# EAGLE design BluetoothBoard (EAGLE 7.5.0)
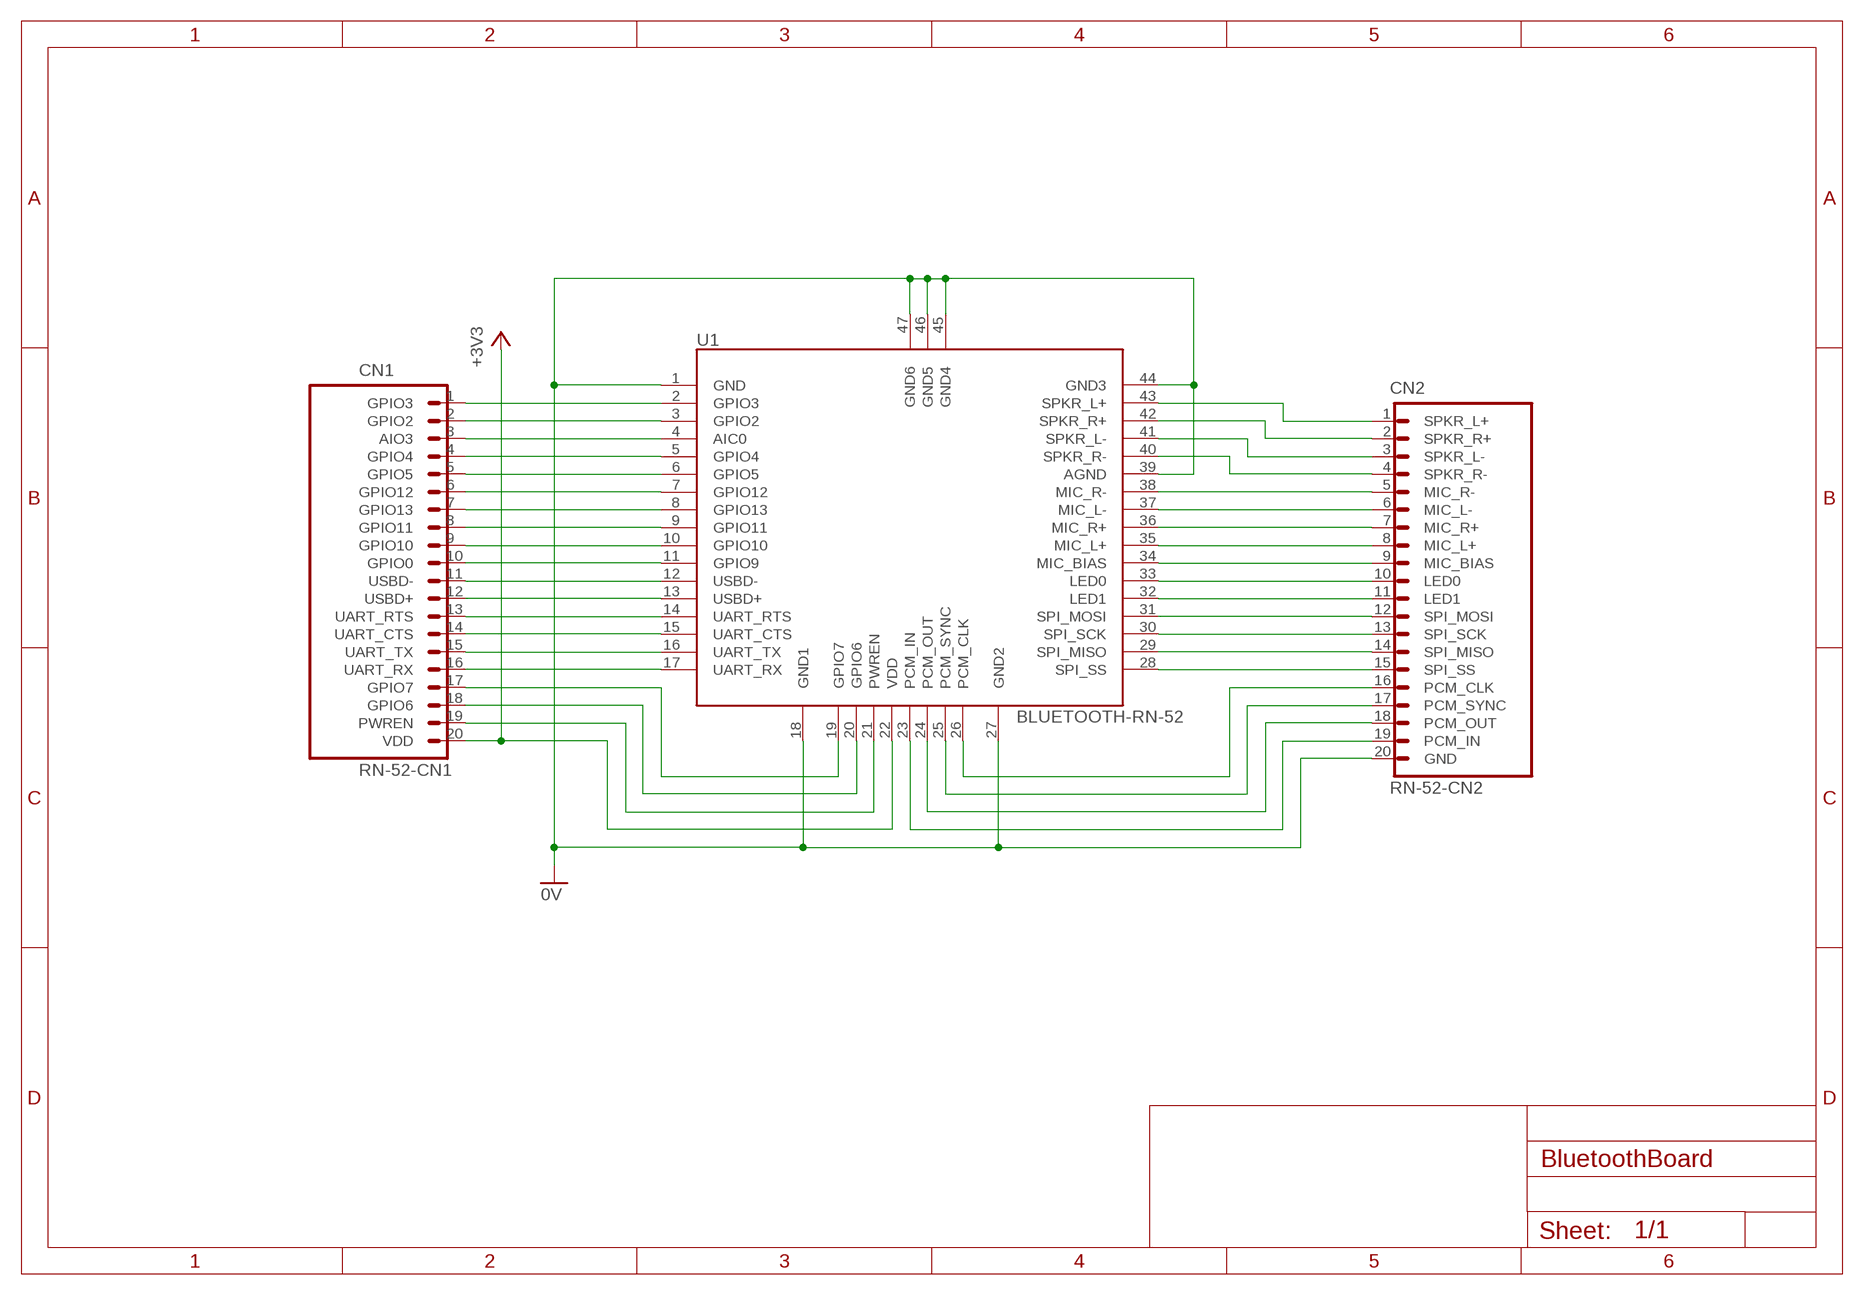
[diagram p0: schematic, sheet 1]

## Parts
CN1  RN-52-CN1  [RN-52-CN1]
CN2  RN-52-CN2  [RN-52-CN2]
U1  BLUETOOTH-RN-52  [RN-52]

## Nets
0V: CN2.20(GND) U1.1(GND) U1.18(GND1) U1.27(GND2) U1.39(AGND) U1.44(GND3) U1.45(GND4) U1.46(GND5) U1.47(GND6)
+3V3: CN1.20(VDD) U1.22(VDD)
N$1: CN1.1(GPIO3) U1.2(GPIO3)
N$2: CN1.2(GPIO2) U1.3(GPIO2)
N$3: CN1.3(AIO3) U1.4(AIC0)
N$4: CN1.4(GPIO4) U1.5(GPIO4)
N$5: CN1.5(GPIO5) U1.6(GPIO5)
N$6: CN1.6(GPIO12) U1.7(GPIO12)
N$7: CN1.7(GPIO13) U1.8(GPIO13)
N$8: CN1.8(GPIO11) U1.9(GPIO11)
N$9: CN1.9(GPIO10) U1.10(GPIO10)
N$10: CN1.10(GPIO0) U1.11(GPIO9)
N$11: CN1.11(USBD-) U1.12(USBD-)
N$12: CN1.12(USBD+) U1.13(USBD+)
N$13: CN1.13(UART_RTS) U1.14(UART_RTS)
N$14: CN1.14(UART_CTS) U1.15(UART_CTS)
N$15: CN1.15(UART_TX) U1.16(UART_TX)
N$16: CN1.16(UART_RX) U1.17(UART_RX)
N$17: CN1.17(GPIO7) U1.19(GPIO7)
N$18: CN1.18(GPIO6) U1.20(GPIO6)
N$19: CN1.19(PWREN) U1.21(PWREN)
N$20: CN2.19(PCM_IN) U1.23(PCM_IN)
N$21: CN2.18(PCM_OUT) U1.24(PCM_OUT)
N$22: CN2.17(PCM_SYNC) U1.25(PCM_SYNC)
N$23: CN2.15(SPI_SS) U1.28(SPI_SS)
N$24: CN2.14(SPI_MISO) U1.29(SPI_MISO)
N$25: CN2.13(SPI_SCK) U1.30(SPI_SCK)
N$26: CN2.12(SPI_MOSI) U1.31(SPI_MOSI)
N$27: CN2.11(LED1) U1.32(LED1)
N$28: CN2.9(MIC_BIAS) U1.34(MIC_BIAS)
N$29: CN2.4(SPKR_R-) U1.40(SPKR_R-)
N$30: CN2.3(SPKR_L-) U1.41(SPKR_L-)
N$31: CN2.2(SPKR_R+) U1.42(SPKR_R+)
N$32: CN2.5(MIC_R-) U1.38(MIC_R-)
N$33: CN2.6(MIC_L-) U1.37(MIC_L-)
N$34: CN2.7(MIC_R+) U1.36(MIC_R+)
N$35: CN2.8(MIC_L+) U1.35(MIC_L+)
N$36: CN2.16(PCM_CLK) U1.26(PCM_CLK)
N$37: CN2.10(LED0) U1.33(LED0)
N$38: CN2.1(SPKR_L+) U1.43(SPKR_L+)

## Library data of the parts
CN1 = PartsForProto:RN-52-CN1: RN-52 インターフェース用ピン
CN2 = PartsForProto:RN-52-CN2: RN-52 インターフェース用ピン
U1 = PartsForProto:BLUETOOTH-RN-52

## Board
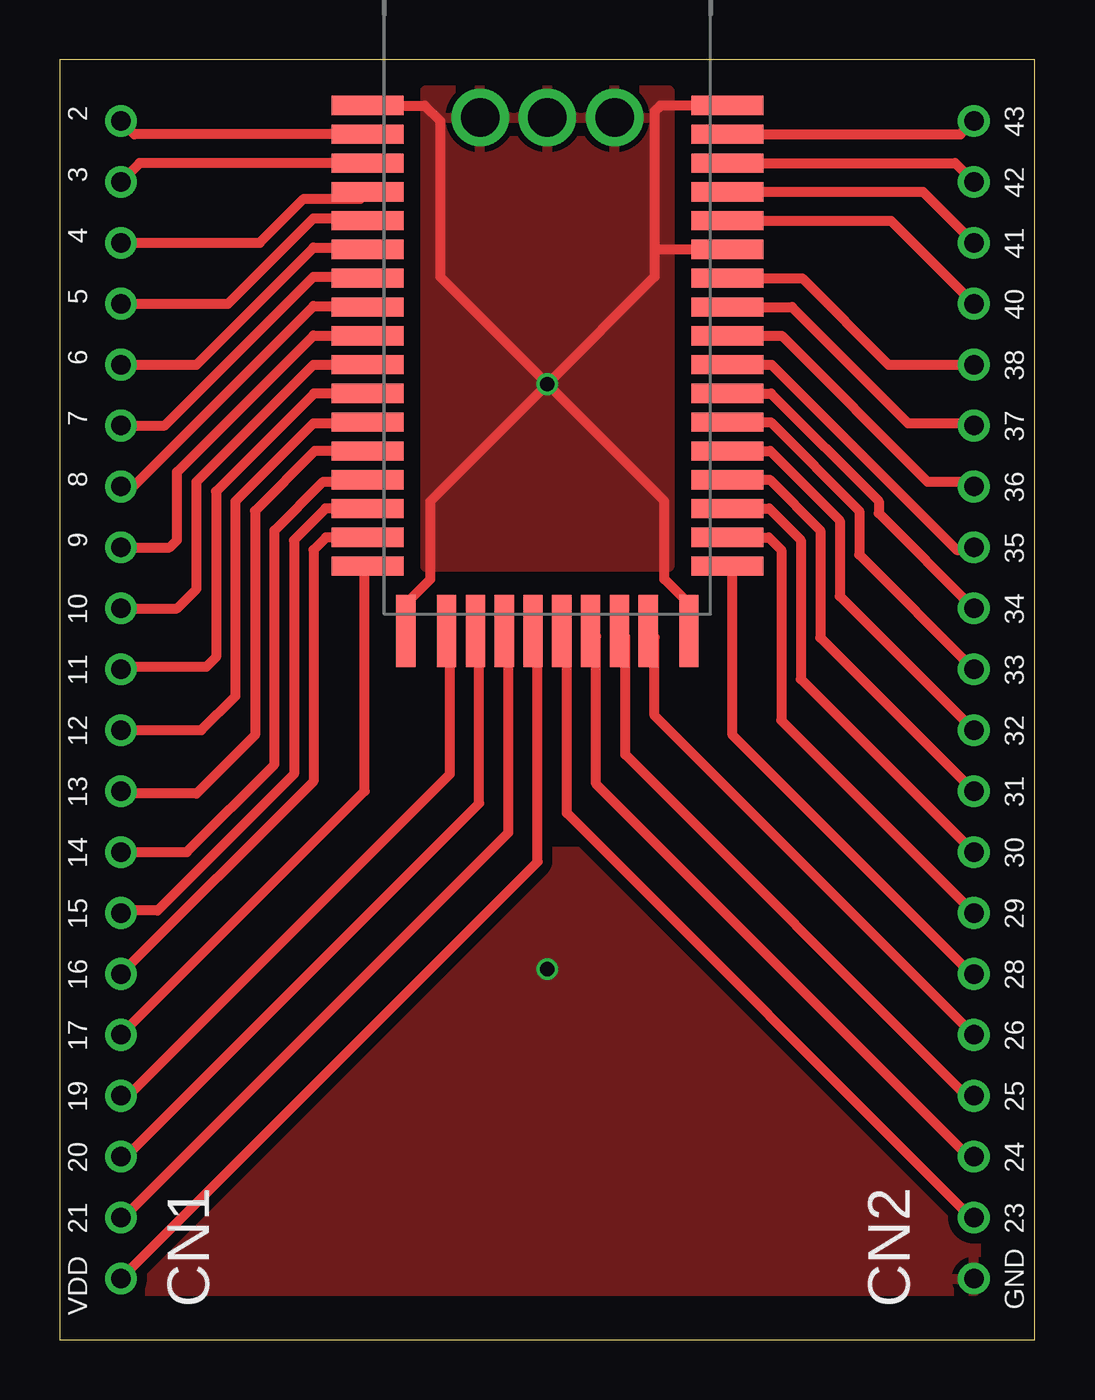
[diagram p1: board, top side]
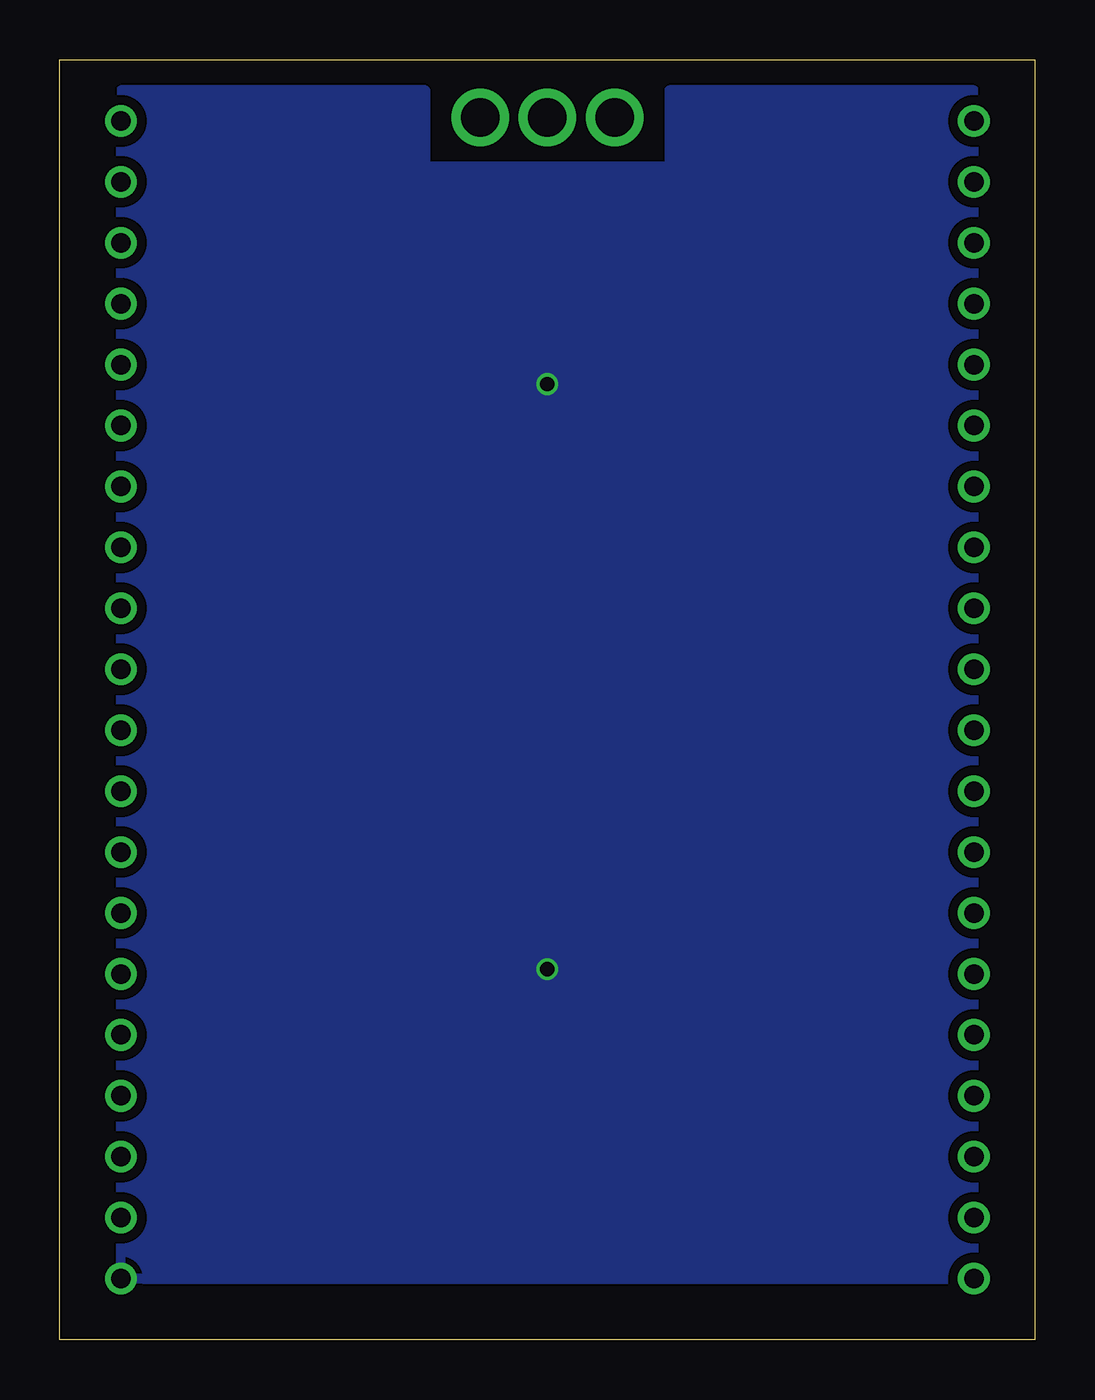
[diagram p2: board, bottom side, seen from below]

Size 40.64 x 53.34 mm. Coordinates in mm from the lower left corner, seen from the top.
Outline: 0,0 40.64,0 40.64,53.34 0,53.34 0,0
Copper layers (1*16): Top 0.035mm / dielectric 1.5mm / Bottom 0.035mm
Design rules "SeeedStudio_2layer_DRU_no_angle_20140221": minimum track width 6mil, minimum drill 12mil, track to track 6mil, track to pad 6mil, pad to pad 6mil, via to via 6mil, smd to smd 0mil, copper to edge 10mil, drill to drill 10mil, minimum pad ring 10mil, minimum via ring 6mil, stop-mask expansion 2mil, vias tented up to drill 100mil, thermal gap 10mil

### Footprints (pad centres in the part's own frame; a part is rotated, then mirrored left to right if it is on the bottom)
RN-52-CN1 = drill 0.813: 1 0,0; 2 2.54,0; 3 5.08,0; 4 7.62,0; 5 10.16,0; 6 12.7,0; 7 15.24,0; 8 17.78,0; 9 20.32,0; 10 22.86,0; 11 25.4,0; 12 27.94,0; 13 30.48,0; 14 33.02,0; 15 35.56,0; 16 38.1,0; 17 40.64,0; 18 43.18,0; 19 45.72,0; 20 48.26,0
RN-52-CN2 = drill 0.813: 1 0,0; 2 2.54,0; 3 5.08,0; 4 7.62,0; 5 10.16,0; 6 12.7,0; 7 15.24,0; 8 17.78,0; 9 20.32,0; 10 22.86,0; 11 25.4,0; 12 27.94,0; 13 30.48,0; 14 33.02,0; 15 35.56,0; 16 38.1,0; 17 40.64,0; 18 43.18,0; 19 45.72,0; 20 48.26,0
RN-52 = smd 3 x 0.8: 1 -7.5,9.53; 2 -7.5,8.33; 3 -7.5,7.13; 4 -7.5,5.93; 5 -7.5,4.73; 6 -7.5,3.53; 7 -7.5,2.33; 8 -7.5,1.13; 9 -7.5,-0.07; 10 -7.5,-1.27; 11 -7.5,-2.47; 12 -7.5,-3.67; 13 -7.5,-4.87; 14 -7.5,-6.07; 15 -7.5,-7.27; 16 -7.5,-8.47; 17 -7.5,-9.67; 28 7.5,-9.67; 29 7.5,-8.47; 30 7.5,-7.27; 31 7.5,-6.07; 32 7.5,-4.87; 33 7.5,-3.67; 34 7.5,-2.47; 35 7.5,-1.27; 36 7.5,-0.07; 37 7.5,1.13; 38 7.5,2.33; 39 7.5,3.53; 40 7.5,4.73; 41 7.5,5.93; 42 7.5,7.13; 43 7.5,8.33; 44 7.5,9.53 | smd 0.8 x 3: 18 -5.9,-12.37; 19 -4.2,-12.37; 20 -3,-12.37; 21 -1.8,-12.37; 22 -0.6,-12.37; 23 0.6,-12.37; 24 1.8,-12.37; 25 3,-12.37; 26 4.2,-12.37; 27 5.9,-12.37 | drill 1.6 pad 2.4: 45 2.8,9.03; 46 0,9.03; 47 -2.8,9.03

### Placement (x,y rotation side)
CN1  2.54,50.8 270 top
CN2  38.1,50.8 270 top
U1  20.32,41.91 0 top

### Tracks (layer width: path | path; a pad name or v marks a point on that pad's centre or on a via)
0V  (via drill 0.6)
  Top 0.406: U1.18 14.42,30.68 15.44,31.7 15.44,34.95 v20.32,39.83 | U1.27 26.22,30.68 25.2,31.7 25.2,34.95 v20.32,39.83 | U1.1 15.21,51.44 15.85,50.8 15.85,44.3 v20.32,39.83 | U1.44 25.02,51.44 24.79,51.21 24.79,45.52 | 24.79,45.52 24.79,44.3 v20.32,39.83 | U1.39 24.87,45.44 24.79,45.52
  other vias: 20.32,15.44
  pour Top (isolate 0.406, rank 3): 15.24,52.07 25.4,52.07 25.4,32.21 15.24,32.21
  pour Bottom (isolate 0.406, rank 3): 2.54,52.07 15.24,52.07 15.24,48.9 25.4,48.9 25.4,52.07 38.1,52.07 38.1,2.54 2.54,2.54
  pour Top (isolate 0.406, rank 3): 19.91,2.03 38.2,2.03 38.2,20.32 2.44,20.32 2.44,2.44 2.44,2.03
+3V3
  Top 0.406: CN1.20 19.91,19.91 19.91,29.35 U1.22
N$1
  Top 0.406: U1.2 3.1,50.24 CN1.1
N$2
  Top 0.406: U1.3 3.32,49.04 CN1.2
N$3
  Top 0.406: CN1.3 8.33,45.72 10.16,47.55 12.53,47.55 U1.4
N$4
  Top 0.406: CN1.4 7.01,43.18 10.57,46.74 12.72,46.74 U1.5
N$5
  Top 0.406: CN1.5 5.69,40.64 10.57,45.52 12.74,45.52 U1.6
N$6
  Top 0.406: CN1.6 4.37,38.1 10.57,44.3 12.88,44.3 | 13.41,44.3 12.88,44.3 | 12.88,44.3 U1.7
N$7
  Top 0.406: CN1.7 3.05,35.56 10.57,43.08 12.78,43.08 U1.8
N$8
  Top 0.406: CN1.8 4.57,33.02 4.88,33.33 4.88,36.17 10.57,41.86 12.8,41.86 U1.9
N$9
  Top 0.406: CN1.9 4.88,30.48 5.69,31.29 5.69,35.76 10.57,40.64 U1.10
N$10
  Top 0.406: U1.11 10.59,39.44 6.5,35.36 6.5,28.45 6.1,28.04 2.64,28.04 CN1.10
N$11
  Top 0.406: CN1.11 5.89,25.4 7.32,26.82 7.32,34.95 10.57,38.2 12.78,38.2 U1.12
N$12
  Top 0.406: U1.13 10.62,37.04 8.13,34.54 8.13,25.2 5.69,22.76 2.64,22.76 CN1.12
N$13
  Top 0.406: CN1.13 5.28,20.32 8.94,23.98 8.94,33.73 10.97,35.76 12.74,35.76 U1.14
N$14
  Top 0.406: U1.15 11.07,34.64 9.75,33.33 9.75,23.57 4.06,17.88 2.64,17.88 CN1.14
N$15
  Top 0.406: U1.16 11.09,33.44 10.57,32.92 10.57,23.27 CN1.15
N$16
  Top 0.406: CN1.16 12.7,22.86 12.7,32.12 U1.17
N$17
  Top 0.406: CN1.17 2.85,10.16 16.26,23.57 16.26,29.4 U1.19
N$18
  Top 0.406: CN1.18 2.74,7.62 17.48,22.35 17.48,29.39 U1.20
N$19
  Top 0.406: CN1.19 2.64,5.08 18.69,21.13 18.69,29.37 U1.21
N$20
  Top 0.406: CN2.19 38,5.08 21.13,21.95 21.13,29.33 U1.23
N$21
  Top 0.406: CN2.18 37.9,7.62 22.35,23.16 22.35,29.31 U1.24
N$22
  Top 0.406: CN2.17 37.8,10.16 23.57,24.38 23.57,29.29 U1.25
N$23
  Top 0.406: CN2.15 38,15.24 28.04,25.2 28.04,32.02 U1.28
N$24
  Top 0.406: U1.29 29.55,33.44 30.07,32.92 30.07,25.81 CN2.14
N$25
  Top 0.406: U1.30 29.57,34.64 30.89,33.33 30.89,27.53 CN2.13
N$26
  Top 0.406: U1.31 29.59,35.84 31.7,33.73 31.7,29.26 CN2.12
N$27
  Top 0.406: U1.32 29.61,37.04 32.51,34.14 32.51,30.99 CN2.11
N$28
  Top 0.406: U1.34 29.65,39.44 34.14,34.95 34.14,34.44 CN2.9
N$29
  Top 0.406: U1.40 34.64,46.64 CN2.4
N$30
  Top 0.406: U1.41 35.98,47.84 CN2.3
N$31
  Top 0.406: U1.42 37.32,49.04 CN2.2
N$32
  Top 0.406: U1.38 30.94,44.24 34.54,40.64 CN2.5
N$33
  Top 0.406: U1.37 30.52,43.04 35.36,38.2 38,38.2 CN2.6
N$34
  Top 0.406: U1.36 30.09,41.84 36.17,35.76 37.9,35.76 CN2.7
N$35
  Top 0.406: U1.35 29.67,40.64 37.39,32.92 38,32.92 CN2.8
N$36
  Top 0.406: CN2.16 24.79,26.01 24.79,29.27 U1.26
N$37
  Top 0.406: U1.33 29.63,38.24 33.33,34.54 33.33,32.72 CN2.10
N$38
  Top 0.406: U1.43 37.54,50.24 CN2.1